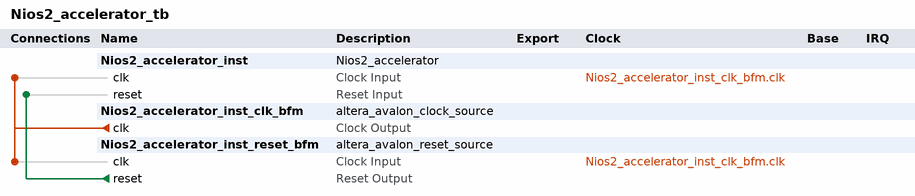
[diagram p0: system contents]
# Platform Designer (Qsys) system Nios2_accelerator_tb, Cyclone V 5CEBA2F17A7
# Parameters at their usual value, and those the tool derives, are not listed.
package require -exact qsys 18.0
create_system Nios2_accelerator_tb
set_project_property DEVICE_FAMILY {Cyclone V}
set_project_property DEVICE 5CEBA2F17A7

add_instance Nios2_accelerator_inst Nios2_accelerator 1.0

add_instance Nios2_accelerator_inst_clk_bfm altera_avalon_clock_source 18.0

add_instance Nios2_accelerator_inst_reset_bfm altera_avalon_reset_source 18.0
set_instance_parameter_value Nios2_accelerator_inst_reset_bfm ASSERT_HIGH_RESET 0
set_instance_parameter_value Nios2_accelerator_inst_reset_bfm INITIAL_RESET_CYCLES 50

# connections
add_connection Nios2_accelerator_inst_clk_bfm.clk Nios2_accelerator_inst.clk clock
add_connection Nios2_accelerator_inst_clk_bfm.clk Nios2_accelerator_inst_reset_bfm.clk clock
add_connection Nios2_accelerator_inst_reset_bfm.reset Nios2_accelerator_inst.reset reset

set_interconnect_requirement {$system} qsys_mm.clockCrossingAdapter HANDSHAKE
set_interconnect_requirement {$system} qsys_mm.enableEccProtection FALSE
set_interconnect_requirement {$system} qsys_mm.insertDefaultSlave FALSE
set_interconnect_requirement {$system} qsys_mm.maxAdditionalLatency 1

save_system Nios2_accelerator_tb.qsys
